# EAGLE schematic Gesture (EAGLE 7.3.0)
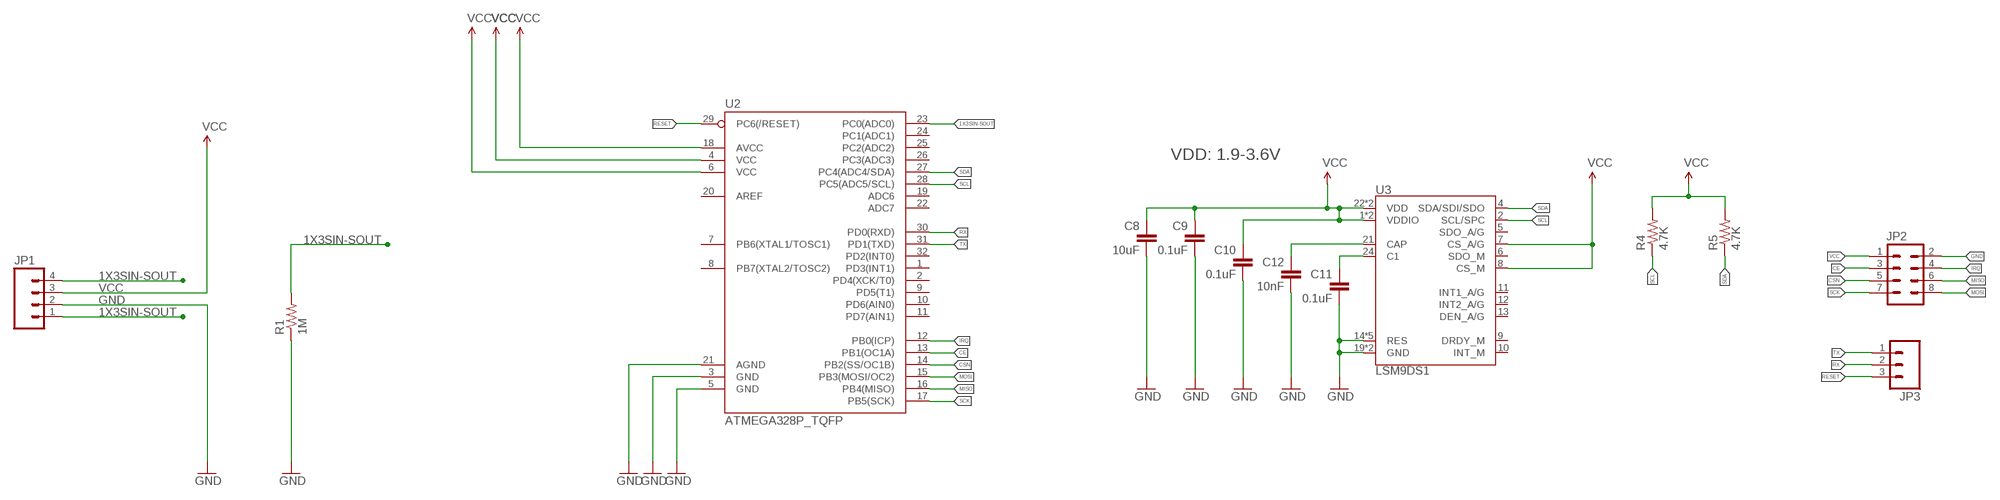
[diagram p0: schematic, sheet 1]

## Parts
C8  10uF  10UF-6.3V-20%(0603)  [0603-CAP]
C9  0.1uF  0.1UF-25V(+80/-20%)(0603)  [0603-CAP]
C10  0.1uF  0.1UF-25V(+80/-20%)(0603)  [0603-CAP]
C11  0.1uF  0.1UF-25V(+80/-20%)(0603)  [0603-CAP]
C12  10nF  10NF/10000PF-50V-10%(0603)  [0603-CAP]
JP1  M04PTH  [1X04]
JP2  M04X2_0.05"  [M04X2_0.05"]
JP3  M03PTH  [1X03]
R1  1M  R-US_R0603  [R0603]
R4  4.7K  4.7KOHM-1/10W-1%(0603)  [0603-RES]
R5  4.7K  4.7KOHM-1/10W-1%(0603)  [0603-RES]
U2  ATMEGA328P_TQFP  [TQFP32-08]
U3  LSM9DS1  [LGA24-8X4]

## Nets
1X3SIN-SOUT: JP1.1 JP1.4 R1.2 U2.23(PC0(ADC0))
CE: JP2.3 U2.13(PB1(OC1A))
CSN: JP2.5 U2.14(PB2(SS/OC1B))
GND: C8.2 C9.2 C10.2 C11.2 C12.2 JP1.2 JP2.2 R1.1 U2.3(GND) U2.5(GND) U2.21(AGND) U3.14(RES) U3.15(RES) U3.16(RES) U3.17(RES) U3.18(RES) U3.19(GND) U3.20(GND)
IRQ: JP2.4 U2.12(PB0(ICP))
MISO: JP2.6 U2.16(PB4(MISO))
MOSI: JP2.8 U2.15(PB3(MOSI/OC2))
N$8: C12.1 U3.21(CAP)
N$10: C11.1 U3.24(C1)
RESET: JP3.3 U2.29(PC6(/RESET))
RX: JP3.2 U2.30(PD0(RXD))
SCK: JP2.7 U2.17(PB5(SCK))
SCL: R4.1 U2.28(PC5(ADC5/SCL)) U3.2(SCL/SPC)
SDA: R5.1 U2.27(PC4(ADC4/SDA)) U3.4(SDA/SDI/SDO)
TX: JP3.1 U2.31(PD1(TXD))
VCC: C8.1 C9.1 C10.1 JP1.3 JP2.1 R4.2 R5.2 U2.4(VCC) U2.6(VCC) U2.18(AVCC) U3.1(VDDIO) U3.3(VDDIO) U3.7(CS_A/G) U3.8(CS_M) U3.22(VDD) U3.23(VDD)
Unconnected: U2.1(PD3(INT1)) U2.2(PD4(XCK/T0)) U2.7(PB6(XTAL1/TOSC1)) U2.8(PB7(XTAL2/TOSC2)) U2.9(PD5(T1)) U2.10(PD6(AIN0)) U2.11(PD7(AIN1)) U2.19(ADC6) U2.20(AREF) U2.22(ADC7) U2.24(PC1(ADC1)) U2.25(PC2(ADC2)) U2.26(PC3(ADC3)) U2.32(PD2(INT0)) U3.5(SDO_A/G) U3.6(SDO_M) U3.9(DRDY_M) U3.10(INT_M) U3.11(INT1_A/G) U3.12(INT2_A/G) U3.13(DEN_A/G)

## Notes on the sheet
- VDD: 1.9-3.6V

## Library data of the parts
C8 = SparkFun-Capacitors:10UF-6.3V-20%(0603): CAP-11015; PROD_ID: CAP-11015
C9-C11 = SparkFun-Capacitors:0.1UF-25V(+80/-20%)(0603): CAP-00810 Ceramic Standard decoupling cap; PROD_ID: CAP-00810
C12 = SparkFun-Capacitors:10NF/10000PF-50V-10%(0603): CAP-00867; PROD_ID: CAP-00867
JP1 = SparkFun-Connectors:M04: Header 4 Standard 4-pin 0.1" header. Use with straight break away headers (SKU : PRT-00116), right angle break away headers (PRT-00553), swiss pins (PRT-00743), machine pins (PRT-00117), and female headers (PRT-00115). Molex polarized connector foot print use with SKU : PRT-08231 with associated crimp pins and housings. 1MM SMD Version SKU: PRT-10208
JP2 = MakerWear:M04X2_0.05": .1" header, two rows of four.
JP3 = SparkFun-Connectors:M03: Header 3 Standard 3-pin 0.1" header. Use with straight break away headers (SKU : PRT-00116), right angle break away headers (PRT-00553), swiss pins (PRT-00743), machine pins (PRT-00117), and female headers (PRT-00115). Molex polarized connector foot print use with SKU : PRT-08232 with associated crimp pins and housings.
R1 = adafruit:R-US_: RESISTOR, American symbol
R4 R5 = SparkFun-Resistors:4.7KOHM-1/10W-1%(0603): RES-07857; PROD_ID: RES-07857
U2 = SparkFun-DigitalIC:ATMEGA328P_TQFP; PROD_ID: IC-09069
U3 = SparkFun-Sensors:LSM9DS1: LSM9DS1 3D accelerometer, gyroscope & magnetometer The LSM9DS1 is a system-in-package featuring a 3D digital linear acceleration sensor, a 3D digital angular rate sensor, and a 3D digital magnetic sensor. The LSM9DS1 has a linear acceleration full scale of ±2g/±4g/±8/±16 g, a magnetic field full scale of ±4/±8/±12/±16 gauss and an angular rate of ±245/±500/±2000 dps. The LSM9DS1 includes an I2 C serial bus interface supporting standard and fast mode (100 kHz and 400 kHz) and an SPI serial standard interface. Magnetic, accelerometer and gyroscope sensing can be enabled or set in power-down mode separately for smart power management. The LSM9DS1 is available in a plastic land grid array package (LGA) and it is guaranteed to operate over an extended temperature range from -40 °C to +85 °C.; PROD_ID: IC-12536